# EAGLE design Guinea_Pig_Schema (EAGLE 9.6.2)
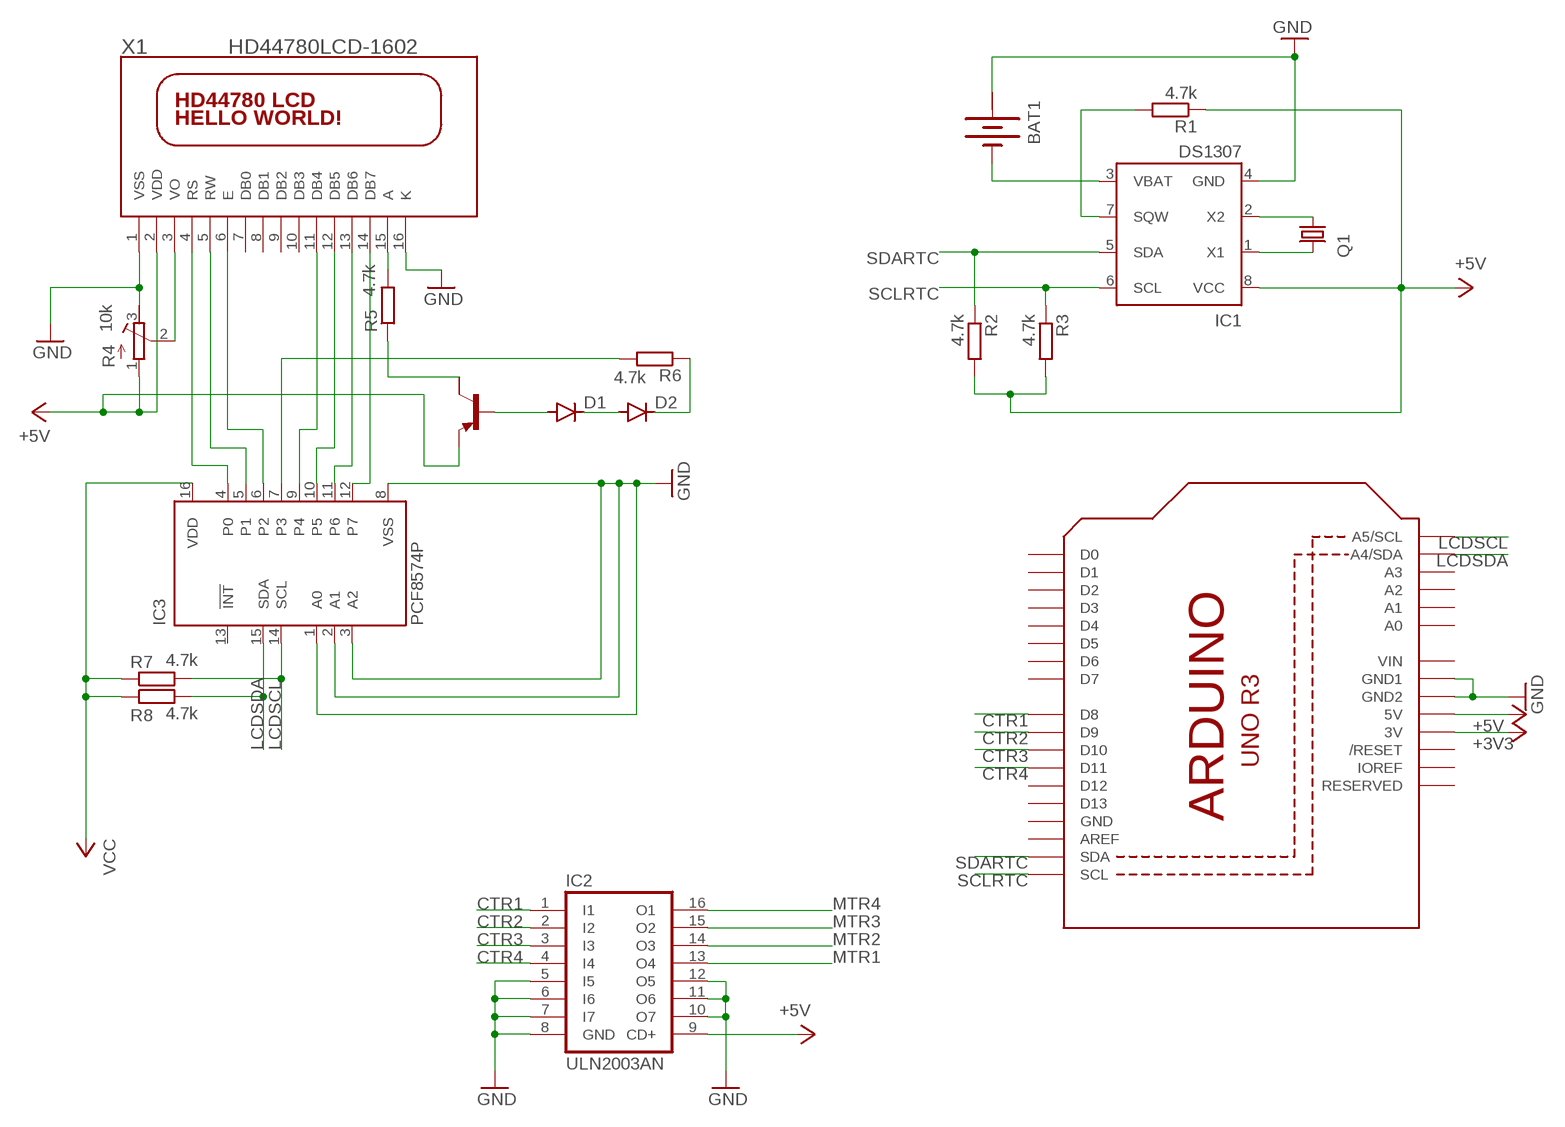
[diagram p0: schematic, sheet 1]

## Parts
BAT1  BATTERY  [BATTERY]
D1  DIODE-DO-214AC  [DO-214AC]
D2  DIODE-DO-214AC  [DO-214AC]
IC1  DS1307  [DIL08]
IC2  ULN2003AN  [DIL16]
IC3  PCF8574P  [DIL16]
Q1  CRYSTAL68SMX  [86SMX]
Q2  PNP-TRANSISTIOR-2COLSOT89  [SOT89]
R1  4.7k  R-EU_R1206  [R1206]
R2  4.7k  R-EU_R1206  [R1206]
R3  4.7k  R-EU_R1206  [R1206]
R4  10k  R-TRIMM3224X  [RTRIM3224X]
R5  4.7k  R-EU_R1206  [R1206]
R6  4.7k  R-EU_R1206  [R1206]
R7  4.7k  R-EU_R1206  [R1206]
R8  4.7k  R-EU_R1206  [R1206]
U1  ARDUINOR3-BPLACE  [ARDUINOR3-BPLACE]
X1  HD44780LCD-1602  [LCD1602]

## Nets
+3V3: U1.3V
+5V: IC2.9(CD+) U1.5V
CTR1: IC2.1(I1) U1.D8
CTR2: IC2.2(I2) U1.D9
CTR3: IC2.3(I3) U1.D10
CTR4: IC2.4(I4) U1.D11
GND: BAT1.+ IC1.4(GND) IC2.5(I5) IC2.6(I6) IC2.7(I7) IC2.8(GND) IC2.10(O7) IC2.11(O6) IC2.12(O5) IC3.1(A0) IC3.2(A1) IC3.3(A2) IC3.8(VSS) R4.3(E) U1.GND1 U1.GND2 X1.1(VSS) X1.16(K)
LCDSCL: IC3.14(SCL) R7.2 U1.A5(A5/SCL)
LCDSDA: IC3.15(SDA) R8.2 U1.A4(A4/SDA)
MTR1: IC2.13(O4)
MTR2: IC2.14(O3)
MTR3: IC2.15(O2)
MTR4: IC2.16(O1)
N$1: IC1.2(X2) Q1.1
N$2: IC1.1(X1) Q1.4
N$3: BAT1.- IC1.3(VBAT)
N$4: R4.2(S) X1.3(VO)
N$5: IC1.7(SQW) R1.2
N$6: IC3.4(P0) X1.4(RS)
N$7: IC3.5(P1) X1.5(RW)
N$8: IC3.6(P2) X1.6(E)
N$9: IC3.9(P4) X1.11(DB4)
N$10: IC3.10(P5) X1.12(DB5)
N$11: IC3.11(P6) X1.13(DB6)
N$12: IC3.12(P7) X1.14(DB7)
N$13: R5.2 X1.15(A)
N$14: Q2.2(C) R5.1
N$15: IC3.7(P3) R6.2
N$16: D1.A Q2.1(B)
N$17: D1.C D2.A
N$18: D2.C R6.1
SCLRTC: IC1.6(SCL) R3.1 U1.SCL
SDARTC: IC1.5(SDA) R2.1 U1.SDA
VCC: IC1.8(VCC) IC3.16(VDD) R1.1 R2.2 R3.2 R7.1 R8.1 ; supply symbol labelled +5V
VDD: Q2.3(E) R4.1(A) X1.2(VDD) ; supply symbol labelled +5V
Unconnected: IC3.13(!INT) Q2.2@1(C/) U1.A0 U1.A1 U1.A2 U1.A3 U1.AREF U1.D0 U1.D1 U1.D2 U1.D3 U1.D4 U1.D5 U1.D6 U1.D7 U1.D12 U1.D13 U1.IOREF U1.RESERVED U1.RESET(/RESET) X1.7(DB0) X1.8(DB1) X1.9(DB2) X1.10(DB3)

## Power pins joined to a net without a drawn wire
+: BAT1.+@1(+)
GND: U1.GND
VIN: U1.VIN

## Library data of the parts
BAT1 = special:BATTERY: BATTERY
D1 D2 = diode:DIODE-: DIODE
IC1 = ds1307_pcf8583:DS1307: I2C-Bus CLOCK/CALENDAR
IC2 = uln-udn:ULN2003A: DRIVER ARRAY
IC3 = micro-philips:PCF8574: I2C-Bus Remote 8-bit I/O expander http://www.semiconductors.philips.com/acrobat_download/datasheets/PCF8574_4.pdf; MPN: PCF8574PN; OC_FARNELL: 204020; OC_NEWARK: 11N8515
Q1 = crystal:CRYSTAL: CRYSTAL; OC_FARNELL: 6344860; OC_NEWARK: unknown
Q2 = semicon-smd-ipc:PNP-TRANSISTIOR-2COL: PNP TRANSISTOR 2 colletor pins
R1-R3 R5-R8 = rcl:R-EU_: RESISTOR, European symbol; SPICEPREFIX: R
R4 = rcl:R-TRIMM: Trimm resistor; SPICEMODEL: X; SPICEPREFIXL: POT
U1 = adafruit:ARDUINOR3: This is a new object for the new Arduino R3 - with extra pins that you may want to use (such as IOref, and duplicated A4/A5
X1 = adafruit:HD44780LCD: HD44780 LCD Standard character type LCDs, available in sizes from 8x1 to 40x4!

## Net classes
0 default: width 0.406 mm

## Board
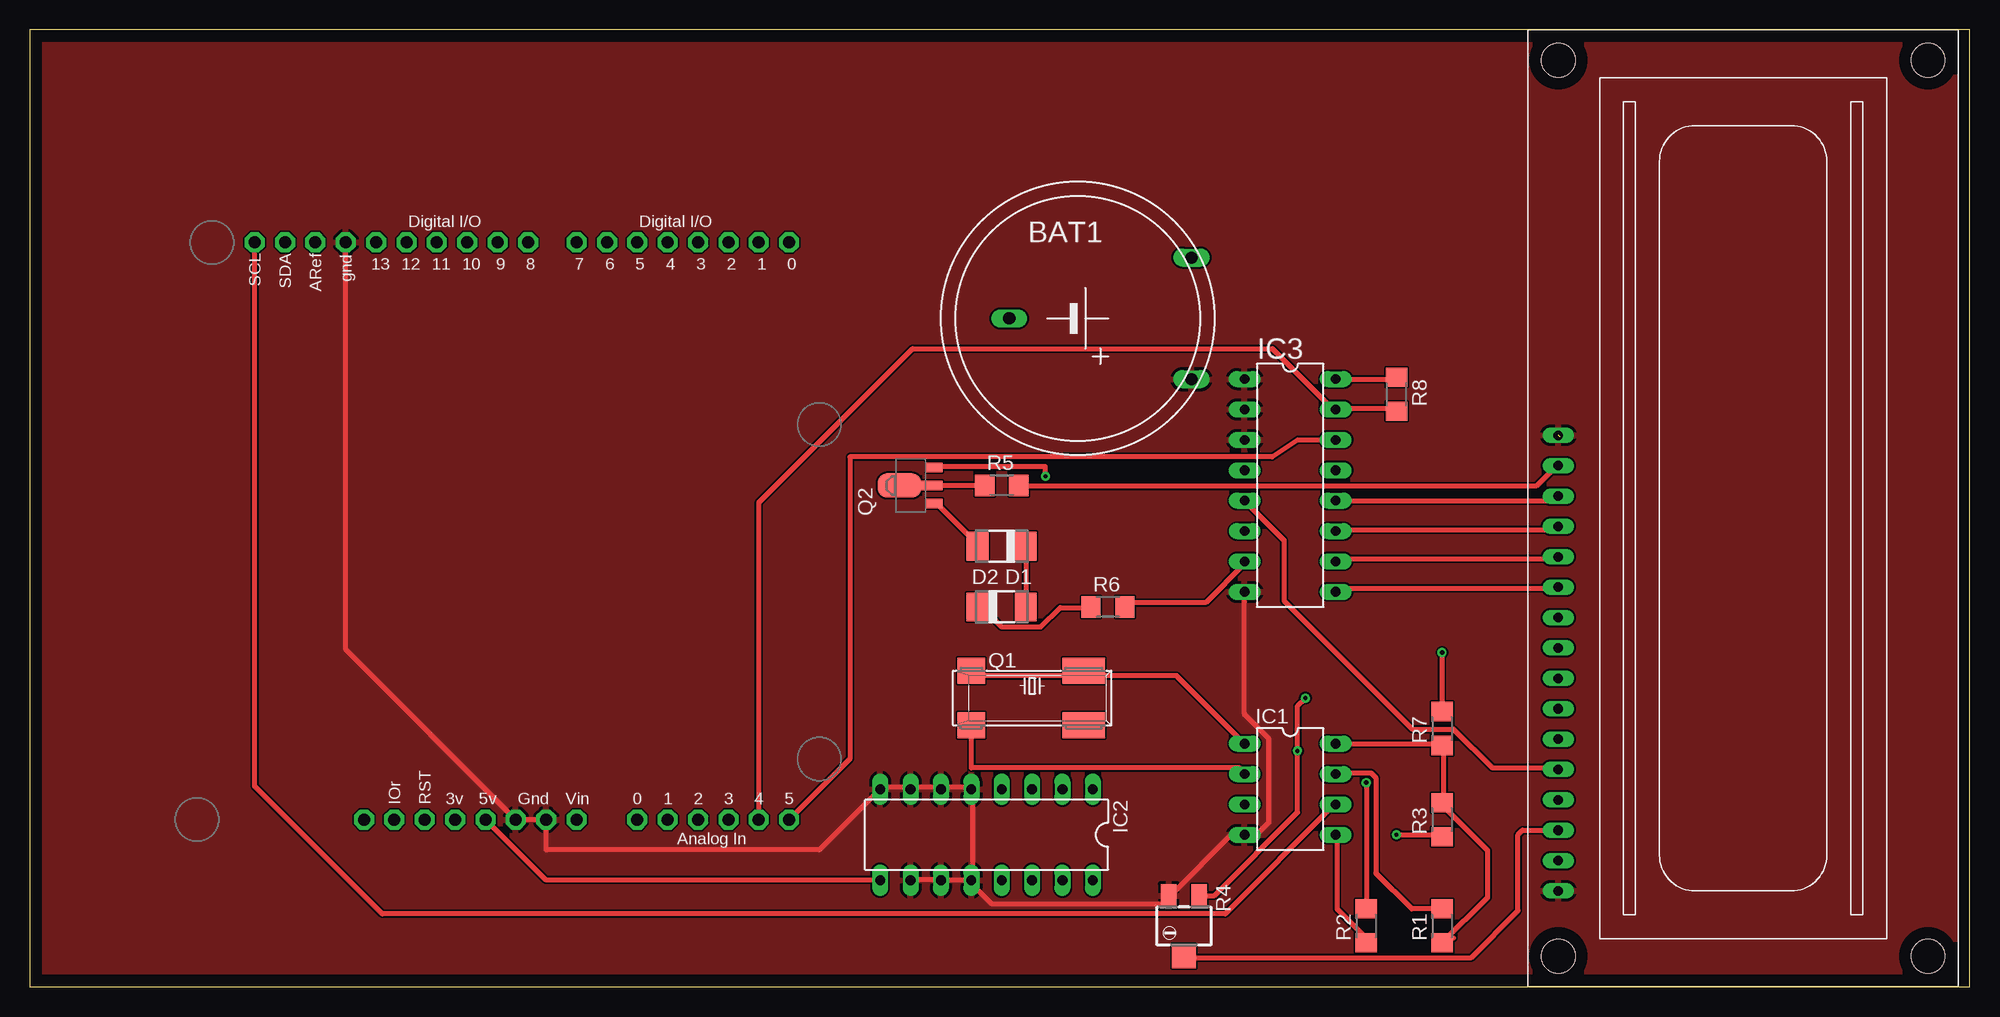
[diagram p1: board, top side]
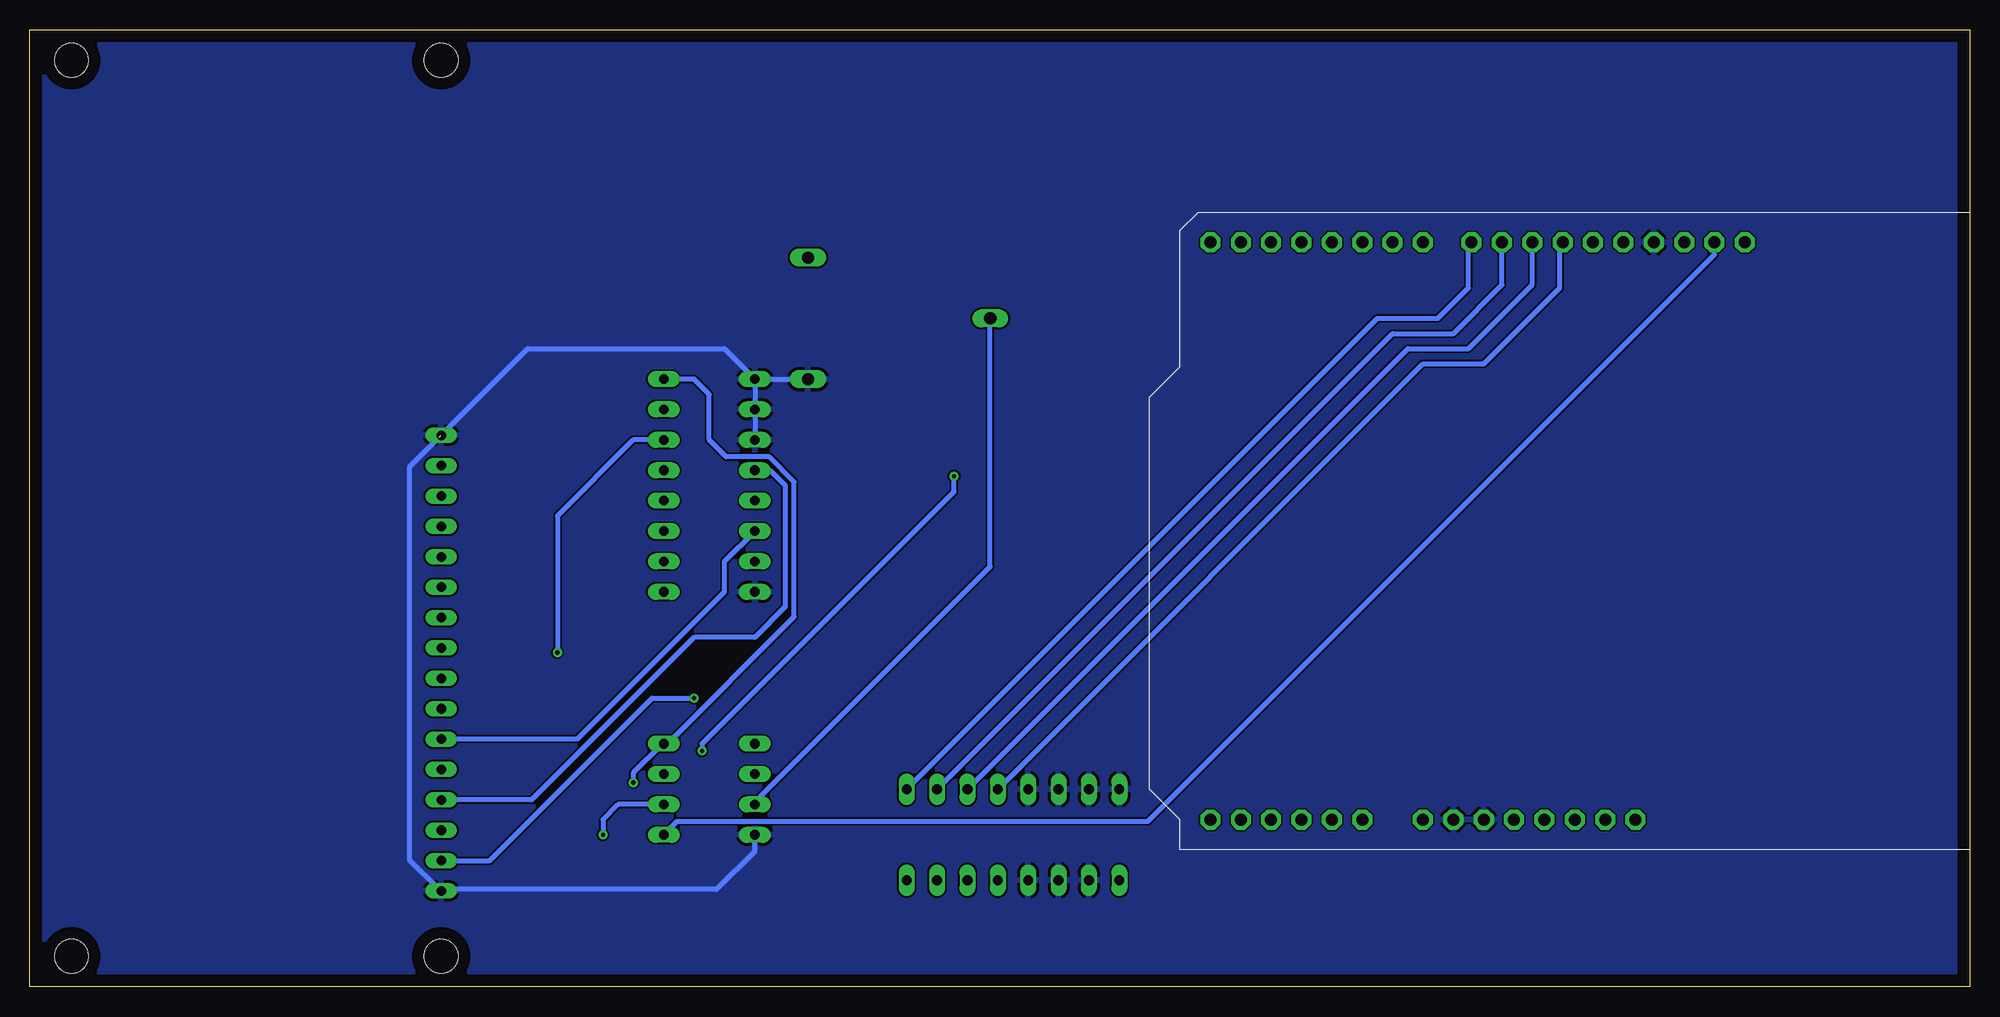
[diagram p2: board, bottom side, seen from below]

Size 162.23 x 80 mm. Coordinates in mm from the lower left corner, seen from the top.
Outline: 0,0 162.23,0 162.23,80 0,80 0,0
Copper layers (1*16): Top 0.035mm / dielectric 1.5mm / Bottom 0.035mm
Design rules "default": minimum track width 6mil, minimum drill 0.35mm, track to track 6mil, track to pad 6mil, pad to pad 6mil, via to via 6mil, smd to smd 6mil, copper to edge 40mil, drill to drill 6mil, minimum pad ring 10mil, minimum via ring 8mil, stop-mask expansion 4mil, vias tented up to drill 0mil, thermal gap 10mil

### Footprints (pad centres in the part's own frame; a part is rotated, then mirrored left to right if it is on the bottom)
BATTERY = drill 1.016 long: + 9.525,-5.08; +@1 9.525,5.08; - -5.715,0
DO-214AC = smd 1.8 x 2.4: A 2.025,0; C -2.025,0
DIL08 = drill 0.813 long: 1 -3.81,-3.81; 2 -1.27,-3.81; 3 1.27,-3.81; 4 3.81,-3.81; 5 3.81,3.81; 6 1.27,3.81; 7 -1.27,3.81; 8 -3.81,3.81
DIL16 = drill 0.813 long: 1 -8.89,-3.81; 2 -6.35,-3.81; 3 -3.81,-3.81; 4 -1.27,-3.81; 5 1.27,-3.81; 6 3.81,-3.81; 7 6.35,-3.81; 8 8.89,-3.81; 9 8.89,3.81; 10 6.35,3.81; 11 3.81,3.81; 12 1.27,3.81; 13 -1.27,3.81; 14 -3.81,3.81; 15 -6.35,3.81; 16 -8.89,3.81
86SMX = smd 2.286 x 2.184: 1 -5.08,-2.286; 4 -5.08,2.286 | smd 3.556 x 2.184: 2 4.318,-2.286; 3 4.318,2.286
SOT89 = smd 0.8 x 1.4: 1 -1.499,-1.981; 3 1.499,-1.981 | smd 0.8 x 1.9: 2 0,-1.727 | smd 2.032 x 3.65: 2@1 0,0.94
R1206 = smd 1.6 x 1.803: 1 -1.422,0; 2 1.422,0
RTRIM3224X = smd 1.32 x 1.9: 1 -1.27,-2.54; 3 1.27,-2.54 | smd 2 x 2: 2 0,2.54
ARDUINOR3-BPLACE = drill 1 pad 1.676 octagon: 3V 35.56,2.54; 5V 38.1,2.54; A0 50.8,2.54; A1 53.34,2.54; A2 55.88,2.54; A3 58.42,2.54; A4 60.96,2.54; A5 63.5,2.54; AREF 23.876,50.8; D0 63.5,50.8; D1 60.96,50.8; D2 58.42,50.8; D3 55.88,50.8; D4 53.34,50.8; D5 50.8,50.8; D6 48.26,50.8; D7 45.72,50.8; D8 41.656,50.8; D9 39.116,50.8; D10 36.576,50.8; D11 34.036,50.8; D12 31.496,50.8; D13 28.956,50.8; GND 26.416,50.8; GND1 43.18,2.54; GND2 40.64,2.54; IOREF 30.48,2.54; RESERVED 27.94,2.54; RESET 33.02,2.54; SCL 18.796,50.8; SDA 21.336,50.8; VIN 45.72,2.54
LCD1602 = drill 0.8 long: 1 8,33.46; 2 10.54,33.46; 3 13.08,33.46; 4 15.62,33.46; 5 18.16,33.46; 6 20.7,33.46; 7 23.24,33.46; 8 25.78,33.46; 9 28.32,33.46; 10 30.86,33.46; 11 33.4,33.46; 12 35.94,33.46; 13 38.48,33.46; 14 41.02,33.46; 15 43.56,33.46; 16 46.1,33.46 | hole 2.8: 2.54,2.54; 2.54,33.46; 77.46,33.46; 77.46,2.54

### Placement (x,y rotation side)
BAT1  87.63,55.88 0 top
D1  81.28,36.83 180 top
D2  81.28,31.75 0 top
IC1  105.41,16.51 270 top
IC2  80.01,12.7 180 top
IC3  105.41,41.91 270 top
Q1  83.82,24.13 0 top
Q2  73.66,41.91 90 top
R1  118.11,5.08 90 top
R2  111.76,5.08 90 top
R3  118.11,13.97 90 top
R4  96.52,5.08 180 top
R5  81.28,41.91 0 top
R6  90.17,31.75 0 top
R7  118.11,21.59 90 top
R8  114.3,49.53 270 top
U1  0,11.43 0 top
X1  161.29,0 90 top

### Tracks (layer width: path | path; a pad name or v marks a point on that pad's centre or on a via)
+5V
  Top 0.406: U1.5V 43.13,8.94 71.12,8.94 IC2.9
CTR1
  Bottom 0.406: 88.59,16.66 IC2.1 49.53,55.88 44.45,55.88 41.91,58.42 41.91,62.23 U1.D8
CTR2
  Bottom 0.406: 86.56,16.26 IC2.2 48.26,54.61 43.18,54.61 39.12,58.67 U1.D9
CTR3
  Bottom 0.406: 83.72,16.66 IC2.3 46.99,53.34 41.91,53.34 36.58,58.67 U1.D10
CTR4
  Bottom 0.406: 81.28,16.66 IC2.4 45.72,52.07 40.64,52.07 34.29,58.42 34.29,61.98 U1.D11
GND  (1 unrouted)
  Top 0.406: IC2.10 73.97,8.94 76,8.94 IC2.11 76.4,8.94 78.44,8.94 IC2.12 | IC2.12 78.84,8.94 78.84,16.26 IC2.5 78.44,16.66 76.4,16.66 IC2.6 76,16.66 73.97,16.66 IC2.7 73.56,16.66 71.12,16.66 IC2.8 66.04,11.43 43.18,11.43 U1.GND1 U1.GND2 26.42,28.19 U1.GND | IC3.8 101.6,22.76 103.63,20.73 103.63,13.77 102.56,12.7 IC1.4 101.6,12.6 100.38,12.6 95.5,7.72 R4.3 95.1,7.32 94.69,6.91 80.47,6.91 78.84,8.53 IC2.12
  Bottom 0.406: IC1.4 101.6,11.33 104.8,8.13 127.61,8.13 X1.1 128.02,8.13 130.45,10.57 130.45,43.48 128.02,45.92 | 71.12,16.26 IC2.8 | X1.16 120.59,53.34 104.14,53.34 IC3.1 | IC3.1 IC3.2 IC3.3 | IC3.1 BAT1.+
  pour Top: 0,80.01 0,0 162.56,0 162.56,80.01
  pour Bottom: 0,80.01 0,0 162.56,0 162.56,80.01
LCDSCL  (via drill 0.35)
  Top 0.406: 118.26,23.16 R7.2 v118.11,27.94 | 109.32,45.52 IC3.14 106.05,45.72 103.91,44.3 68.58,44.3 68.58,19.05 U1.A5
  Bottom 0.406: IC3.14 111.76,45.72 118.11,39.37 v118.11,27.94
LCDSDA
  Top 0.406: R8.2 114.2,48.36 109.32,48.36 IC3.15 108.92,48.36 103.94,53.34 73.84,53.34 60.96,40.46 U1.A4
N$1
  Top 0.406: Q1.1 78.74,18.29 101.19,18.29 101.6,17.88 IC1.2
N$2
  Top 0.406: IC1.1 95.91,26.01 78.54,26.01 Q1.4
N$3
  Bottom 0.406: IC1.3 101.6,15.44 81.92,35.13 BAT1.-
N$4
  Top 0.406: R4.2 96.72,2.44 120.55,2.44 124.46,6.35 124.46,12.7 124.84,13.08 X1.3
N$5
  Top 0.406: R1.2 115.57,6.5 112.57,9.5 112.57,17.48 112.17,17.88 109.32,17.88 IC1.7
N$6
  Bottom 0.406: 128.02,15.85 X1.4 120.27,15.62 106.68,29.21 101.6,29.21 99.06,31.75 99.06,41.91 100.33,43.18 IC3.4
N$7
  Top 0.406: IC3.5 104.9,37.34 104.9,32.26 115.62,21.54 119.08,21.54 122.33,18.29 127.61,18.29 X1.5
N$8
  Bottom 0.406: X1.6 127.61,20.73 116.43,20.73 104.14,33.02 104.14,35.56 IC3.6 101.6,37.8
N$9
  Top 0.406: X1.11 127.61,33.33 109.32,33.33 IC3.9
N$10
  Top 0.406: X1.12 127.61,35.76 109.32,35.76 IC3.10
N$11
  Top 0.406: X1.13 127.61,38.2 109.32,38.2 IC3.11
N$12
  Top 0.406: IC3.12 127.61,40.64 X1.14
N$13
  Top 0.406: R5.2 82.91,41.86 125.98,41.86 127.61,43.48 X1.15
N$14
  Top 0.406: R5.1 79.65,41.86 79.6,41.91 Q2.2 | 75.39,41.86 Q2.2 | Q2.2 74.9,41.91
N$15
  Top 0.406: R6.2 91.85,32.11 98.35,32.11 101.6,35.36 IC3.7
N$16
  Top 0.406: Q2.1 75.79,40.23 76,40.23 79.25,36.98 D1.A
N$17
  Top 0.406: D2.A 83.31,32.11 83.31,36.58 D1.C
N$18
  Top 0.406: R6.1 88.59,31.7 86.16,31.7 84.53,30.07 81.28,30.07 79.65,31.7 D2.C
SCLRTC  (via drill 0.35)
  Top 0.406: 117.86,12.6 118.08,12.55 | 118.08,12.55 R3.1 | 108.92,15.44 IC1.6 108.92,15.04 99.97,6.1 29.46,6.1 18.8,16.76 U1.SCL | v114.3,12.7 117.94,12.7 118.08,12.55
  Bottom 0.406: IC1.6 113.03,15.24 114.3,13.97 v114.3,12.7
SDARTC
  Top 0.406: R2.1 111.76,4.06 109.32,6.5 109.32,12.6 IC1.5
  Bottom 0.406: IC1.5 108.1,13.82 68.73,13.82 21.34,61.21 U1.SDA
VCC  (via drill 0.35)
  Top 0.406: 119.08,4.06 118.26,4.06 R1.1 121.92,7.47 121.92,11.38 118.26,15.04 R3.2 118.26,15.44 118.26,19.91 R7.1 117.86,20.32 IC1.8 | IC3.16 114.2,50.8 R8.1 | v111.76,17.07 R2.2
  Bottom 0.406: v111.76,17.07 111.76,17.88 109.32,20.32 IC1.8 108.92,20.32 98.3,30.94 98.3,42.22 100.38,44.3 103.99,44.3 105.41,45.72 105.41,49.53 106.68,50.8 IC3.16 108.92,50.8
VDD  (via drill 0.35)
  Top 0.406: v84.94,42.67 84.94,43.48 75.79,43.48 Q2.3 | R4.1 99.06,7.62 106.02,14.58 v106.02,19.71 106.02,23.47 v106.68,24.13
  Bottom 0.406: v84.94,42.67 84.94,41.4 105.72,20.62 106.02,20.32 v106.02,19.71 | 127.61,10.57 X1.2 123.77,10.54 110.18,24.13 v106.68,24.13